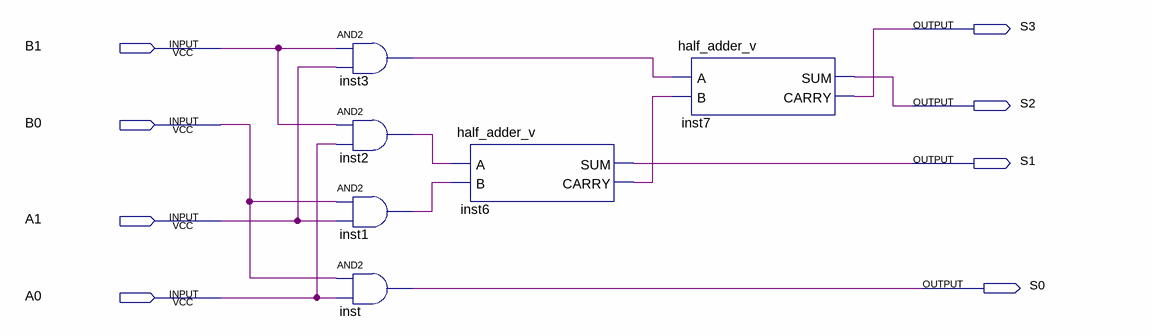
[diagram p0: schematic sheet]
// Quartus schematic 2bit_multiplier.bdf as structural Verilog: 6 symbols, 8 pins
module \2bit_multiplier  (
  input  B1,
  input  B0,
  input  A1,
  input  A0,
  output S3,
  output S2,
  output S1,
  output S0
);

  wire inst1_out, inst2_out, inst3_out, inst6_carry;

  and inst3 (inst3_out, B1, A1);
  and inst2 (inst2_out, B1, A0);
  and inst1 (inst1_out, B0, A1);
  and inst (S0, B0, A0);
  half_adder_v inst6 (.A(inst2_out), .B(inst1_out), .SUM(S1), .CARRY(inst6_carry));
  half_adder_v inst7 (.A(inst3_out), .B(inst6_carry), .SUM(S2), .CARRY(S3));
endmodule
